# EAGLE design E4m (EAGLE 7.6.0)
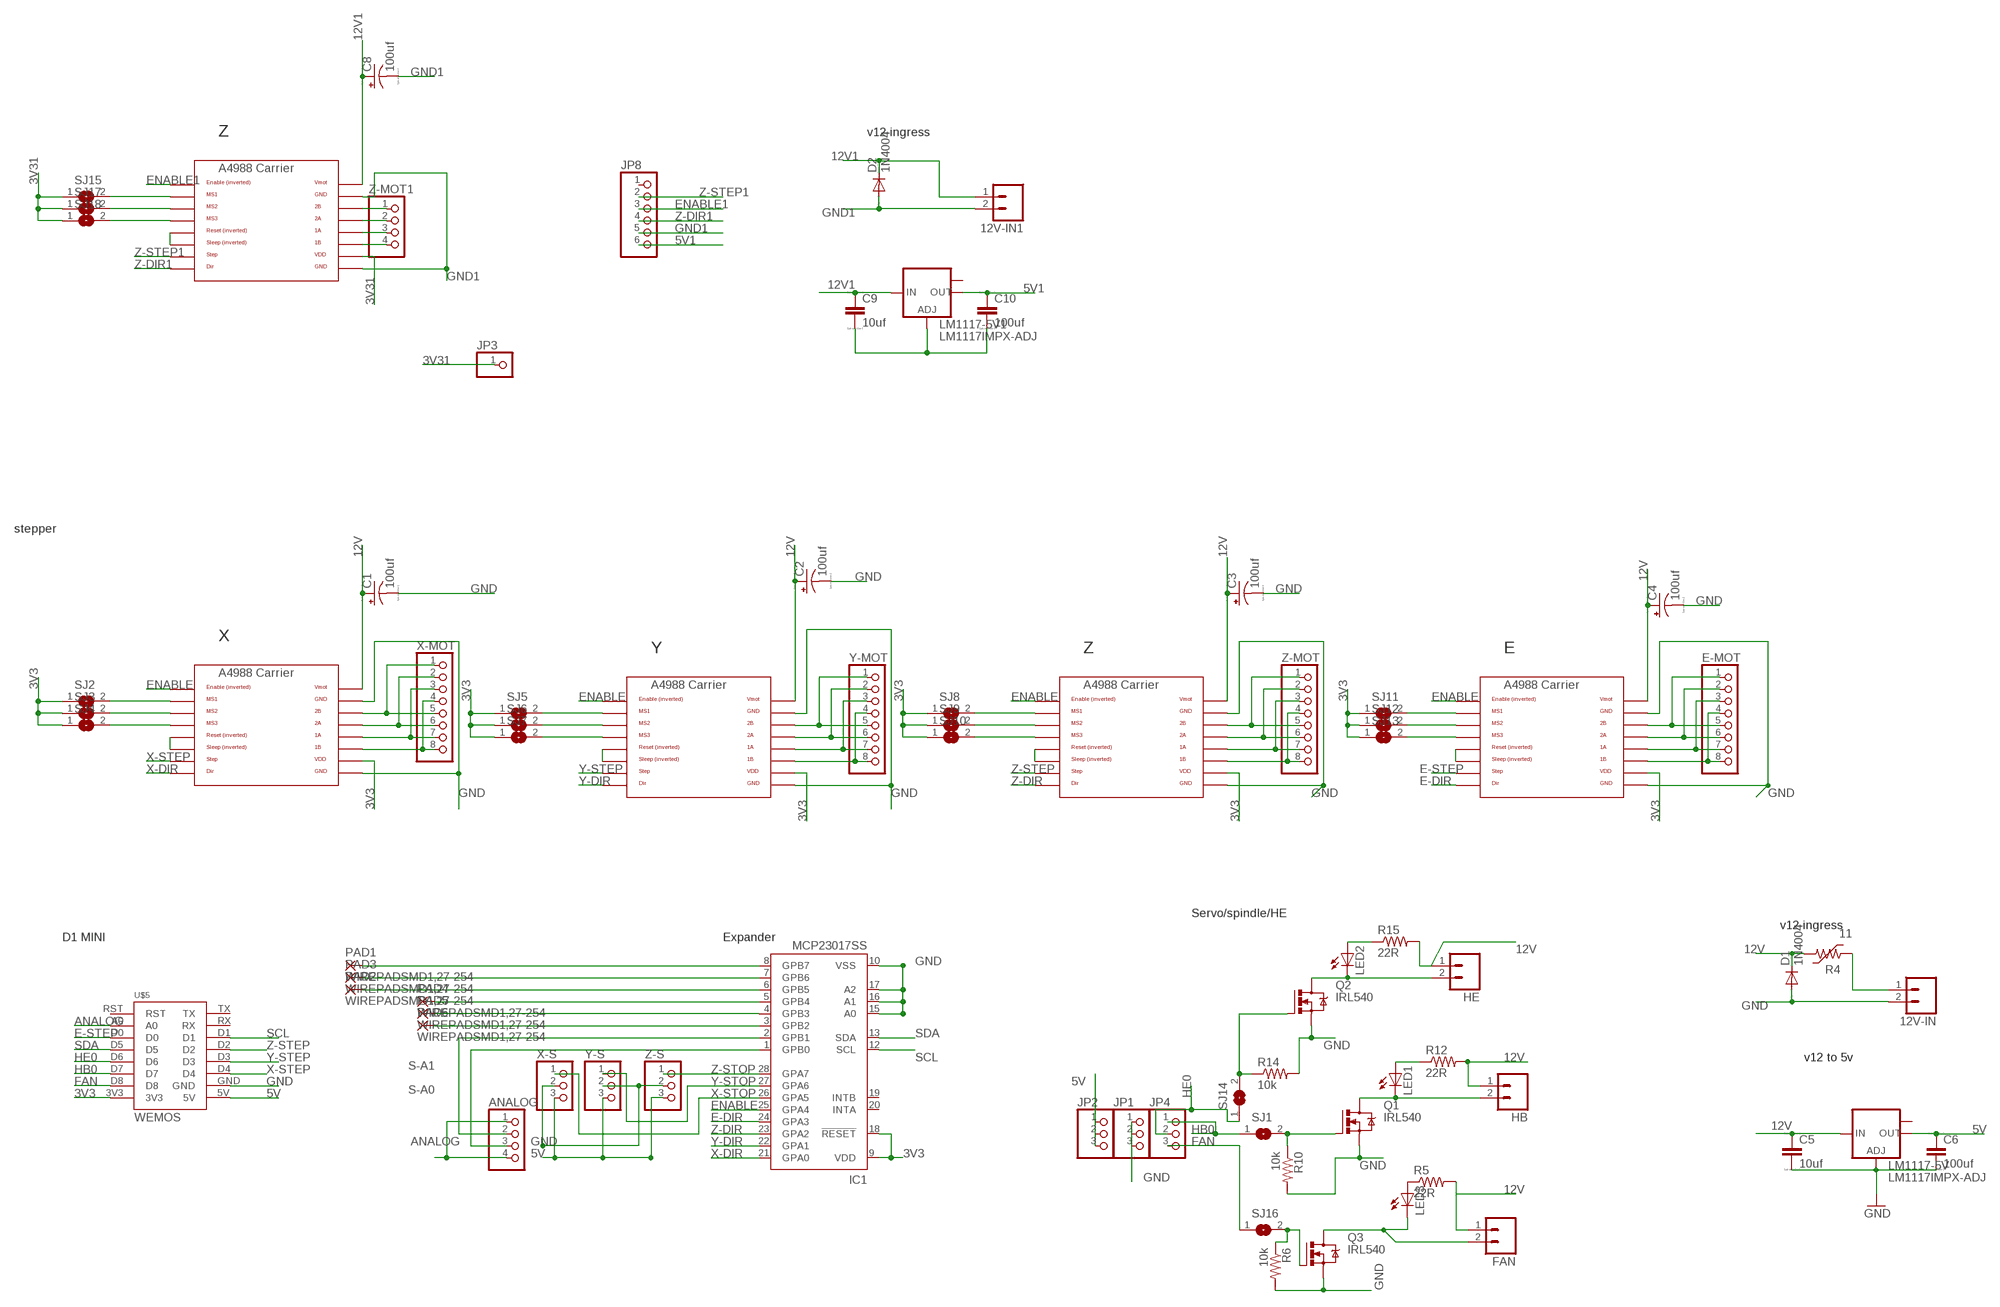
[diagram p0: schematic, sheet 1]

## Parts
12V-IN  M02PTH  [1X02]
12V-IN1  M02PTH  [1X02]
ANALOG  PINHD-1X4  [1X04]
C1  100uf  CPOL-US153CLV-0605  [153CLV-0605]
C2  100uf  CPOL-US153CLV-0605  [153CLV-0605]
C3  100uf  CPOL-US153CLV-0605  [153CLV-0605]
C4  100uf  CPOL-US153CLV-0605  [153CLV-0605]
C5  10uf  C  [C0805]
C6  100uf  C  [C0805]
C8  100uf  CPOL-US153CLV-0605  [153CLV-0605]
C9  10uf  CC0603  [C0603]
C10  100uf  CC0603  [C0603]
D1  1N4004  [DO41-10]
D2  1N4004  [DO41-10]
E-MOT  PINHD-1X8CLEANBIG  [1X08-CLEANBIG]
FAN  M02PTH  [1X02]
HB  M02PTH  [1X02]
HE  M02PTH  [1X02]
IC1  MCP23017SS  [SSOP28]
JP1  PINHD-1X3CB  [1X03-CLEANBIG]
JP2  PINHD-1X3CB  [1X03-CLEANBIG]
JP3  PINHD-1X1CB  [1X01-CLEANBIG]
JP4  PINHD-1X3CB  [1X03-CLEANBIG]
JP8  PINHD-1X6  [1X06]
LED1  LEDCHIP-LED0805  [CHIP-LED0805]
LED2  LEDCHIP-LED0805  [CHIP-LED0805]
LED3  LEDCHIP-LED0805  [CHIP-LED0805]
LM1117-5V  LM1117IMPX-ADJ  [SOT223]
LM1117-5V1  LM1117IMPX-ADJ  [SOT223]
PAD1  WIREPADSMD1,27-254  [SMD1,27-2,54]
PAD2  WIREPADSMD1,27-254  [SMD1,27-2,54]
PAD3  WIREPADSMD1,27-254  [SMD1,27-2,54]
PAD4  WIREPADSMD1,27-254  [SMD1,27-2,54]
PAD5  WIREPADSMD1,27-254  [SMD1,27-2,54]
PAD6  WIREPADSMD1,27-254  [SMD1,27-2,54]
Q1  IRL540  IRF540  [TO220BV]
Q2  IRL540  IRF540  [TO220BV]
Q3  IRL540  IRF540  [TO220BV]
R4  11  PTC-PF-8.0  [PF-8.0]
R5  22R  R-US_R0805  [R0805]
R6  10k  R-US_R0805  [R0805]
R10  10k  R-US_R0805  [R0805]
R12  22R  R-US_R0805  [R0805]
R14  10k  R-US_R0805  [R0805]
R15  22R  R-US_R0805  [R0805]
SJ1  SJ  [SJ]
SJ2  SJ  [SJ]
SJ3  SJ  [SJ]
SJ4  SJ  [SJ]
SJ5  SJ  [SJ]
SJ6  SJ  [SJ]
SJ7  SJ  [SJ]
SJ8  SJ  [SJ]
SJ9  SJ  [SJ]
SJ10  SJ  [SJ]
SJ11  SJ  [SJ]
SJ12  SJ  [SJ]
SJ13  SJ  [SJ]
SJ14  SJ  [SJ]
SJ15  SJ  [SJ]
SJ16  SJ  [SJ]
SJ17  SJ  [SJ]
SJ18  SJ  [SJ]
U$1  A4988BREAKOUT  [A4988BREAKOUT]
U$2  A4988BREAKOUT  [A4988BREAKOUT]
U$3  A4988BREAKOUT  [A4988BREAKOUT]
U$5  WEMOS  [WEMOS]
U$6  A4988BREAKOUT  [A4988BREAKOUT]
U$9  A4988BREAKOUT  [A4988BREAKOUT]
X-MOT  PINHD-1X8CLEANBIG  [1X08-CLEANBIG]
X-S  PINHD-1X3CB  [1X03-CLEANBIG]
Y-MOT  PINHD-1X8CLEANBIG  [1X08-CLEANBIG]
Y-S  PINHD-1X3CB  [1X03-CLEANBIG]
Z-MOT  PINHD-1X8CLEANBIG  [1X08-CLEANBIG]
Z-MOT1  PINHD-1X4  [1X04]
Z-S  PINHD-1X3CB  [1X03-CLEANBIG]

## Nets
3V3: IC1.9(VDD) IC1.18(!RESET) SJ2.1 SJ3.1 SJ4.1 SJ5.1 SJ6.1 SJ7.1 SJ8.1 SJ9.1 SJ10.1 SJ11.1 SJ12.1 SJ13.1 U$1.VDD U$2.VDD U$3.VDD U$5.3V3 U$9.VDD
3V31: JP3.1 SJ15.1 SJ17.1 SJ18.1 U$6.VDD
5V: C6.1 JP2.1 JP2.2 JP2.3 LM1117-5V.2(OUT) U$5.5V X-S.3 Y-S.3 Z-S.3
5V1: C10.1 JP8.6 LM1117-5V1.2(OUT)
12V [Power]: C1.+ C2.+ C3.+ C4.+ C5.1 D1.C FAN.1 HB.1 HE.1 LM1117-5V.3(IN) R4.2 R5.2 R12.2 R15.2 U$1.VMOT U$2.VMOT U$3.VMOT U$9.VMOT
12V1 [Power]: 12V-IN1.1 C8.+ C9.1 D2.C LM1117-5V1.3(IN) U$6.VMOT
ANALOG: ANALOG.1 ANALOG.4 U$5.A0
AUX2 [aux]: IC1.8(GPB7) PAD1.1(P)
E-DIR: IC1.24(GPA3) U$2.DIR
E-STEP: U$2.STEP U$5.D0
ENABLE: IC1.25(GPA4) U$1.EN U$2.EN U$3.EN U$9.EN
ENABLE1: JP8.3 U$6.EN
FAN: JP4.3 SJ16.1 U$5.D8
GND: 12V-IN.2 C1.- C2.- C3.- C4.- C5.2 C6.2 D1.A IC1.10(VSS) IC1.15(A0) IC1.16(A1) IC1.17(A2) JP1.1 JP1.2 JP1.3 LM1117-5V.1(ADJ) Q1.S Q2.S Q3.S R6.2 R10.2 R14.2 U$1.GND U$1.GND@0(GND) U$2.GND U$2.GND@0(GND) U$3.GND U$3.GND@0(GND) U$5.GND U$9.GND U$9.GND@0(GND) X-S.2 Y-S.2 Z-S.2
GND1: 12V-IN1.2 C8.- D2.A JP8.5 U$6.GND U$6.GND@0(GND)
HB0: JP4.1 SJ1.1 U$5.D7
HE0: JP4.2 SJ14.1 U$5.D6
N$1: LED3.A R5.1
N$3 [aux]: IC1.7(GPB6) PAD3.1(P)
N$4: SJ12.2 U$2.MS2
N$5: U$2.RST U$2.SLP(SLEEP)
N$6: SJ13.2 U$2.MS3
N$7: SJ11.2 U$2.MS1
N$8 [line]: U$3.1B Y-MOT.4 Y-MOT.8
N$9 [line]: U$3.1A Y-MOT.3 Y-MOT.7
N$10: U$3.2A Y-MOT.2 Y-MOT.6
N$11 [line]: U$3.2B Y-MOT.1 Y-MOT.5
N$12 [line]: U$1.1B X-MOT.4 X-MOT.8
N$13 [Power]: HB.2 LED1.C Q1.D
N$14 [line]: U$1.1A X-MOT.3 X-MOT.7
N$15: U$1.2A X-MOT.2 X-MOT.6
N$16 [line]: U$1.2B X-MOT.1 X-MOT.5
N$17 [line]: U$9.1B Z-MOT.4 Z-MOT.8
N$18: FAN.2 LED3.C Q3.D
N$19 [aux]: IC1.3(GPB2) PAD6.1(P)
N$20 [line]: U$9.1A Z-MOT.3 Z-MOT.7
N$21 [aux]: IC1.6(GPB5) PAD2.1(P)
N$22 [aux]: IC1.5(GPB4) PAD4.1(P)
N$23: Q2.G R14.1 SJ14.2
N$24: SJ3.2 U$1.MS2
N$25: U$9.RST U$9.SLP(SLEEP)
N$26 [aux]: IC1.4(GPB3) PAD5.1(P)
N$27: Q3.G R6.1 SJ16.2
N$28: U$3.RST U$3.SLP(SLEEP)
N$29: U$1.RST U$1.SLP(SLEEP)
N$30 [Power]: 12V-IN.1 R4.1
N$34: SJ4.2 U$1.MS3
N$35: SJ2.2 U$1.MS1
N$37: SJ17.2 U$6.MS2
N$39: SJ18.2 U$6.MS3
N$40: SJ15.2 U$6.MS1
N$41 [line]: U$6.2B Z-MOT1.1
N$42 [line]: U$6.2A Z-MOT1.2
N$43 [line]: U$6.1A Z-MOT1.3
N$44 [line]: U$6.1B Z-MOT1.4
N$45: U$6.RST U$6.SLP(SLEEP)
N$46: U$9.2A Z-MOT.2 Z-MOT.6
N$48 [line]: U$9.2B Z-MOT.1 Z-MOT.5
N$49: C9.2 C10.2 LM1117-5V1.1(ADJ)
N$50 [line]: E-MOT.4 E-MOT.8 U$2.1B
N$51 [line]: E-MOT.3 E-MOT.7 U$2.1A
N$54: LED1.A R12.1
N$55: E-MOT.2 E-MOT.6 U$2.2A
N$56: SJ6.2 U$3.MS2
N$57 [Power]: HE.2 LED2.C Q2.D
N$58: SJ7.2 U$3.MS3
N$59: SJ5.2 U$3.MS1
N$60 [line]: E-MOT.1 E-MOT.5 U$2.2B
N$64: SJ9.2 U$9.MS2
N$65: LED2.A R15.1
N$66: SJ10.2 U$9.MS3
N$67: SJ8.2 U$9.MS1
N$S4: Q1.G R10.1 SJ1.2
S-A0: ANALOG.3 IC1.1(GPB0)
S-A1: ANALOG.2 IC1.2(GPB1)
SCL: IC1.12(SCL) U$5.D1
SDA: IC1.13(SDA) U$5.D5
X-DIR: IC1.21(GPA0) U$1.DIR
X-STEP: U$1.STEP U$5.D4
X-STOP: IC1.26(GPA5) X-S.1
Y-DIR: IC1.22(GPA1) U$3.DIR
Y-STEP: U$3.STEP U$5.D3
Y-STOP: IC1.27(GPA6) Y-S.1
Z-DIR: IC1.23(GPA2) U$9.DIR
Z-DIR1: JP8.4 U$6.DIR
Z-STEP: U$5.D2 U$9.STEP
Z-STEP1: JP8.2 U$6.STEP
Z-STOP: IC1.28(GPA7) Z-S.1
Unconnected: IC1.19(INTB) IC1.20(INTA) JP8.1 LM1117-5V1.TAB(OUT1) LM1117-5V.TAB(OUT1) U$5.RST U$5.RX U$5.TX

## Notes on the sheet
- Z | v12 ingress
- stepper
- X
- Y | Z | E
- Servo/spindle/HE
- v12 ingress
- D1 MINI | Expander
- v12 to 5v

## Library data of the parts
12V-IN 12V-IN1 FAN HB HE = SparkFun:M02: Header 2 Standard 2-pin 0.1" header. Use with straight break away headers (SKU : PRT-00116), right angle break away headers (PRT-00553), swiss pins (PRT-00743), machine pins (PRT-00117), and female headers (PRT-00115). Molex polarized connector foot print use with SKU : PRT-08233 with associated crimp pins and housings.
ANALOG Z-MOT1 = RepRapjr:PINHD-1X4: PIN HEADER
C1-C4 C8 = resistor:CPOL-US: POLARIZED CAPACITOR, American symbol
C5 C6 C9 C10 = eagle-ltspice:C: CAPACITOR, European symbol; SPICEMODEL: NONE; SPICEPREFIX: C
D1 D2 = diode:1N4004: DIODE general purpose rectifier, 1 A
E-MOT X-MOT Y-MOT Z-MOT = adafruit:PINHD-1X8: PIN HEADER
IC1 = adafruit:MCP23017: http://ww1.microchip.com/downloads/en/DeviceDoc/21952a.pdf Source: http://ww1.microchip.com/downloads/en/DeviceDoc/21952a.pdf
JP1 JP2 JP4 X-S Y-S Z-S = adafruit:PINHD-1X3: PIN HEADER
JP3 = adafruit:PINHD-1X1: Pin header 1x1 for 0.1" spacing With round pins
JP8 = adafruit:PINHD-1X6: PIN HEADER
LED1-LED3 = RepRapjr:LED: LED OSRAM: - CHIPLED LG R971, LG N971, LY N971, LG Q971, LY Q971, LO R971, LY R971 LH N974, LH R974 LS Q976, LO Q976, LY Q976 LO Q996 - Hyper CHIPLED LW Q18S LB Q993, LB Q99A, LB R99A - SideLED LS A670, LO A670, LY A670, LG A670, LP A670 LB A673, LV A673, LT A673, LW A673 LH A674 LY A675 LS A676, LA A676, LO A676, LY A676, LW A676 LS A679, LY A679, LG A679 - Hyper Micro SIDELED® LS Y876, LA Y876, LO Y876, LY Y876 LT Y87S - SmartLED LW L88C, LW L88S LB L89C, LB L89S, LG L890 LS L89K, LO L89K, LY L89K LS L896, LA L896, LO L896, LY L896 - TOPLED LS T670, LO T670, LY T670, LG T670, LP T670 LSG T670, LSP T670, LSY T670, LOP T670, LYG T670 LG T671, LOG T671, LSG T671 LB T673, LV T673, LT T673, LW T673 LH T674 LS T676, LA T676, LO T676, LY T676, LB T676, LH T676, LSB T676, LW T676 LB T67C, LV T67C, LT T67C, LS T67K, LO T67K, LY T67K, LW E67C LS E67B, LA E67B, LO E67B, LY E67B, LB E67C, LV E67C, LT E67C LW T67C LS T679, LY T679, LG T679 LS T770, LO T770, LY T770, LG T770, LP T770 LB T773, LV T773, LT T773, LW T773 LH T774 LS E675, LA E675, LY E675, LS T675 LS T776, LA T776, LO T776, LY T776, LB T776 LHGB T686 LT T68C, LB T68C - Hyper Mini TOPLED® LB M676 - Mini TOPLED Santana® LG M470 LS M47K, LO M47K, LY M47K Source: http://www.osram.convergy.de LUXEON: - LUMILED® LXK2-PW12-R00, LXK2-PW12-S00, LXK2-PW14-U00, LXK2-PW14-V00 LXK2-PM12-R00, LXK2-PM12-S00, LXK2-PM14-U00 LXK2-PE12-Q00, LXK2-PE12-R00, LXK2-PE12-S00, LXK2-PE14-T00, LXK2-PE14-U00 LXK2-PB12-K00, LXK2-PB12-L00, LXK2-PB12-M00, LXK2-PB14-N00, LXK2-PB14-P00, LXK2-PB14-Q00 LXK2-PR12-L00, LXK2-PR12-M00, LXK2-PR14-Q00, LXK2-PR14-R00 LXK2-PD12-Q00, LXK2-PD12-R00, LXK2-PD12-S00 LXK2-PH12-R00, LXK2-PH12-S00 LXK2-PL12-P00, LXK2-PL12-Q00, LXK2-PL12-R00 Source: www.luxeon.com KINGBRIGHT: KA-3528ASYC Source: www.kingbright.com
LM1117-5V LM1117-5V1 = lm1117:LM1117IMPX-ADJ
PAD1-PAD6 = wirepad:WIREPAD: Wire PAD connect wire on PCB
Q1-Q3 = smootietransistor-power:IRF540: HEXFET Power MOSFET
R4 = polyswitch:PTC-: POLYSWITCH Polyswitch Resetable Fuses
R5 R6 R10 R12 R14 R15 = adafruit:R-US_: RESISTOR, American symbol
SJ1-SJ18 = jumper:SJ: SMD solder JUMPER
U$1-U$3 U$6 U$9 = RepRapjr:A4988BREAKOUT
U$5 = 1455413453956-wemos:WEMOS

## Net classes
1 Power: width 0.8 mm
2 line: width 0.4 mm
3 aux: width 0.2 mm

## Board
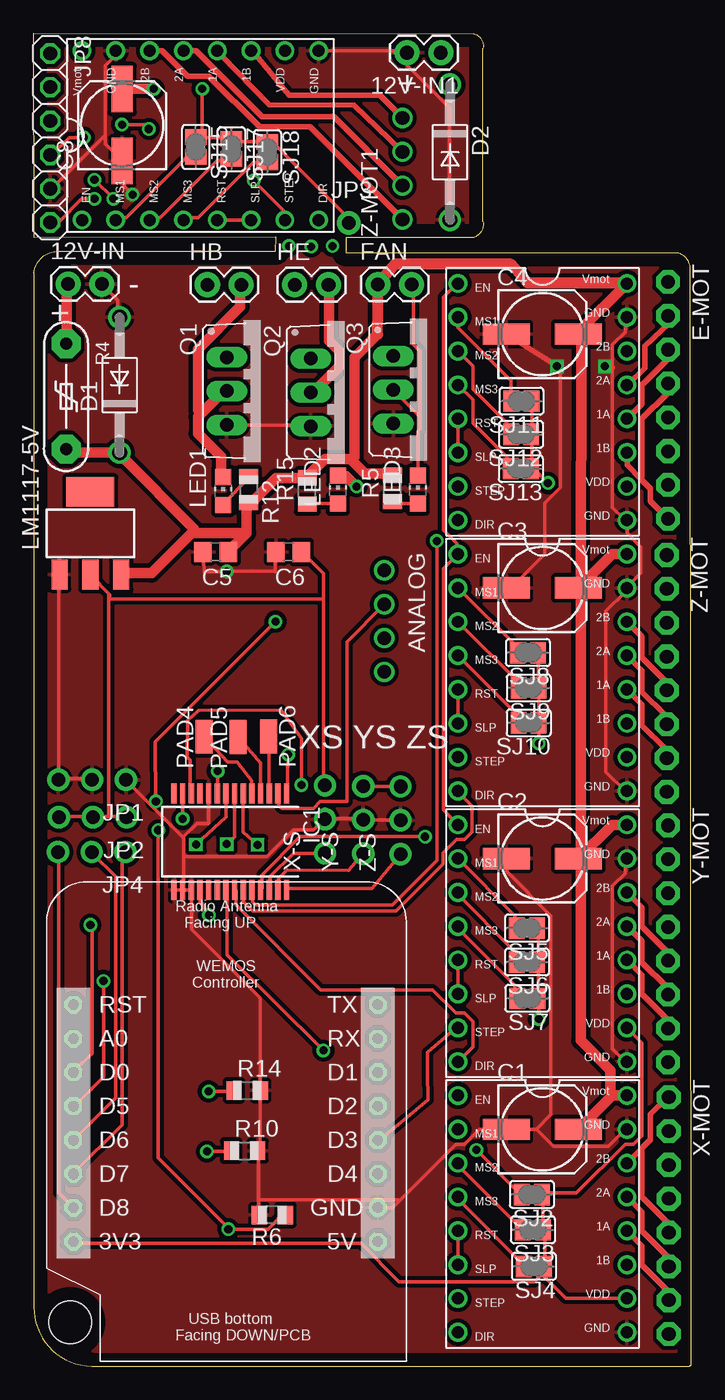
[diagram p1: board, top side]
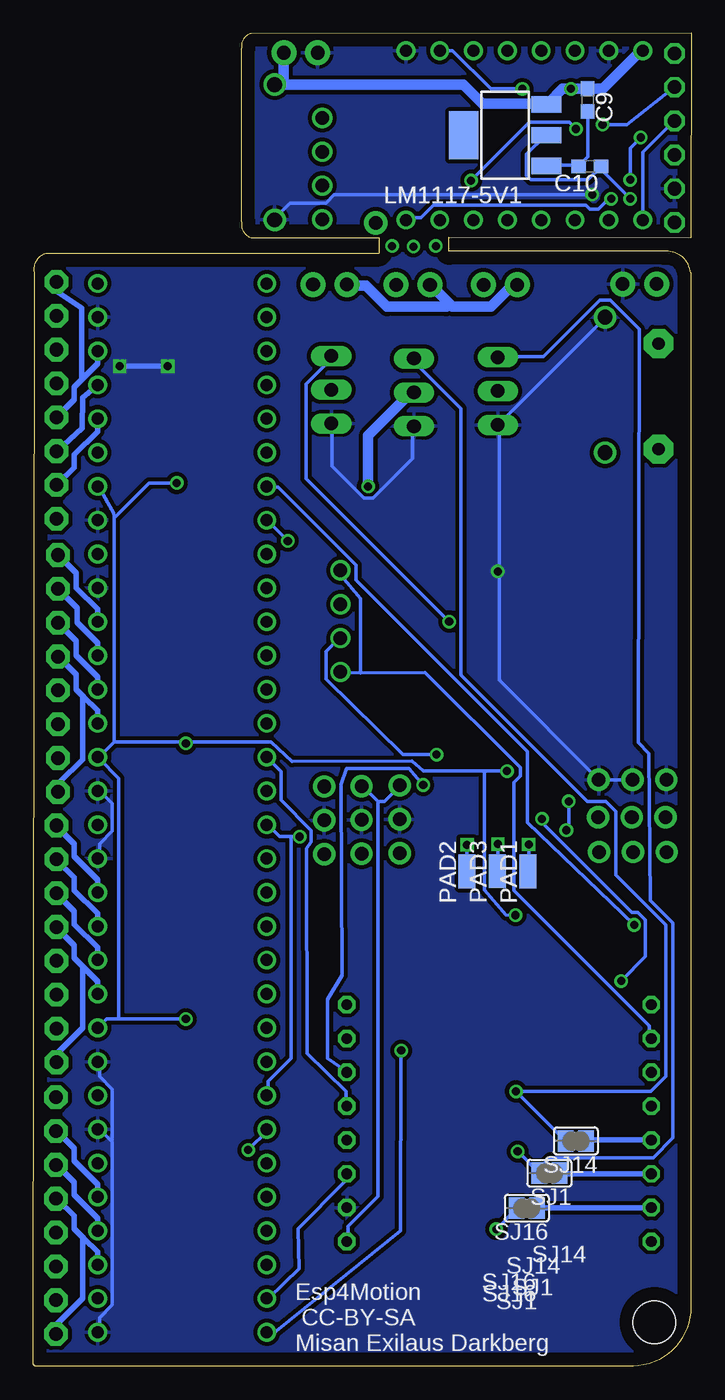
[diagram p2: board, bottom side, seen from below]

Size 49.41 x 100.05 mm. Coordinates in mm from the lower left corner, seen from the top.
Outline: 49.41,0.21 49.31,82.11 arc90 48.37,83.56 23.47,83.56 23.47,84.7 32.98,84.7 arc90 33.77,85.93 33.77,98.93 arc90 33.05,100.03 0.02,100.05
Outline: 0,100.05 0.03,84.73 18.22,84.75 18.19,83.69 2.07,83.69 arc90 0.05,82.07 0.05,4.47 arc90 4.37,0 49.2,0 arc90 49.41,0.21
Copper layers (1*16): Top 0.035mm / dielectric 1.5mm / Bottom 0.035mm
Design rules "default *": minimum track width 10mil, minimum drill 24mil, track to track 8mil, track to pad 8mil, pad to pad 8mil, via to via 8mil, smd to smd 8mil, copper to edge 40mil, drill to drill 8mil, minimum pad ring 10mil, minimum via ring 8mil, stop-mask expansion 4mil, vias tented up to drill 0mil, thermal gap 10mil
Holes 3.2 mm at 2.77,3.3

### Footprints (pad centres in the part's own frame; a part is rotated, then mirrored left to right if it is on the bottom)
1X02 = drill 1.016 pad 1.88: 1 0,0; 2 2.54,0
1X04 = drill 1.016: 1 -2.54,0; 2 0,0; 3 2.54,0; 4 5.08,0
153CLV-0605 = smd 3.5 x 1.6: + 2.7,0; - -2.7,0
C0805 = smd 1.3 x 1.5: 1 -0.95,0; 2 0.95,0
C0603 = smd 1.1 x 1: 1 -0.85,0; 2 0.85,0
DO41-10 = drill 1.118: A 5.08,0; C -5.08,0
1X08-CLEANBIG = drill 1.016 pad 1.778 octagon: 1 -8.89,0; 2 -6.35,0; 3 -3.81,0; 4 -1.27,0; 5 1.27,0; 6 3.81,0; 7 6.35,0; 8 8.89,0
SSOP28 = smd 0.4 x 1.5: 1 -4.225,-3.625; 2 -3.575,-3.625; 3 -2.925,-3.625; 4 -2.275,-3.625; 5 -1.625,-3.625; 6 -0.975,-3.625; 7 -0.325,-3.625; 8 0.325,-3.625; 9 0.975,-3.625; 10 1.625,-3.625; 11 2.275,-3.625; 12 2.925,-3.625; 13 3.575,-3.625; 14 4.225,-3.625; 15 4.225,3.625; 16 3.575,3.625; 17 2.925,3.625; 18 2.275,3.625; 19 1.625,3.625; 20 0.975,3.625; 21 0.325,3.625; 22 -0.325,3.625; 23 -0.975,3.625; 24 -1.625,3.625; 25 -2.275,3.625; 26 -2.925,3.625; 27 -3.575,3.625; 28 -4.225,3.625
1X03-CLEANBIG = drill 1.016 pad 1.676: 1 -2.54,0; 2 0,0; 3 2.54,0
1X01-CLEANBIG = drill 1.016 pad 1.778: 1 0,0
1X06 = drill 1.016 octagon: 1 -6.35,0; 2 -3.81,0; 3 -1.27,0; 4 1.27,0; 5 3.81,0; 6 6.35,0
CHIP-LED0805 = smd 1.2 x 1.2: A 0,-1.05; C 0,1.05
SOT223 = smd 1.219 x 2.235: 1 -2.311,-3.099; 2 0,-3.099; 3 2.311,-3.099 | smd 3.6 x 2.2: TAB 0,3.099
SMD1,27-2,54 = smd 1.27 x 2.54: 1 0,0
TO220BV = drill 1.016 long: D 0,-2.54; G -2.54,-2.54; S 2.54,-2.54
PF-8.0 = drill 0.914 pad 2.184 octagon: 1 -3.969,0; 2 3.969,0
R0805 = smd 1.1 x 1.4: 1 -1,0; 2 1,0
SJ = smd 1.168 x 1.6: 1 -0.762,0; 2 0.762,0
A4988BREAKOUT = drill 0.9: 1A 8.89,1.27; 1B 11.43,1.27; 2A 6.35,1.27; 2B 3.81,1.27; DIR 16.51,-11.43; EN -1.27,-11.43; GND 16.51,1.27; GND@0 1.27,1.27; MS1 1.27,-11.43; MS2 3.81,-11.43; MS3 6.35,-11.43; RST 8.89,-11.43; SLP 11.43,-11.43; STEP 13.97,-11.43; VDD 13.97,1.27; VMOT -1.27,1.27
WEMOS = drill 0.8 octagon: 3V3 0,0; 5V 22.86,0; A0 0,15.24; D0 0,12.7; D1 22.86,12.7; D2 22.86,10.16; D3 22.86,7.62; D4 22.86,5.08; D5 0,10.16; D6 0,7.62; D7 0,5.08; D8 0,2.54; GND 22.86,2.54; RST 0,17.78; RX 22.86,15.24; TX 22.86,17.78

### Placement (x,y rotation side)
12V-IN  2.61,81.24 0 top
12V-IN1  30.6,98.6 180 top
ANALOG  26.35,57.2 270 top
C1  38.23,17.78 0 top
C2  38.23,38.1 0 top
C3  38.23,58.42 0 top
C4  38.23,77.47 0 top
C5  13.69,61.13 180 top
C6  19.17,61.13 180 top
C8  6.67,93.16 90 top
C9  7.8,95.04 270 bottom
C10  7.62,90.06 180 bottom
D1  6.48,73.66 90 top
D2  31.29,91.13 270 top
E-MOT  47.67,72.5 270 top
FAN  25.87,81.2 0 top
HB  13.07,81.18 0 top
HE  19.63,81.18 0 top
IC1  14.79,39.38 180 top
JP1  4.42,44.02 180 top
JP2  4.47,41.2 180 top
JP3  23.7,85.83 0 top
JP4  4.39,38.6 180 top
JP8  1.27,92.2 270 top
LED1  14.27,65.7 0 top
LED2  22.87,65.8 0 top
LED3  28.87,65.8 0 top
LM1117-5V  4.29,62.53 0 top
LM1117-5V1  13.99,92.4 90 bottom
PAD1  12.27,37.13 0 bottom
PAD2  16.84,37.13 0 bottom
PAD3  14.55,37.16 0 bottom
PAD4  12.84,47.25 0 top
PAD5  15.39,47.22 0 top
PAD6  17.65,47.27 180 top
Q1  17.07,73.2 270 top
Q2  23.37,73.1 270 top
Q3  29.57,73.3 270 top
R4  2.46,72.8 270 top
R5  26.97,65.9 90 top
R6  17.94,11.36 180 top
R10  15.86,16.18 0 top
R12  16.17,65.8 270 top
R14  16.07,20.7 0 top
R15  20.57,65.7 90 top
SJ1  10.65,14.49 180 bottom
SJ2  37.44,12.88 180 top
SJ3  37.52,10.23 180 top
SJ4  37.6,7.49 180 top
SJ5  37.07,32.88 180 top
SJ6  37.07,30.33 180 top
SJ7  37.1,27.61 180 top
SJ8  37.15,53.56 180 top
SJ9  37.2,50.92 180 top
SJ10  37.2,48.3 180 top
SJ11  36.66,72.44 180 top
SJ12  36.63,69.95 180 top
SJ13  36.6,67.38 180 top
SJ14  8.67,16.9 180 bottom
SJ15  12.2,91.52 270 top
SJ16  12.36,11.86 180 bottom
SJ17  14.87,91.37 270 top
SJ18  17.58,91.14 270 top
U$1  43.31,19.05 270 top
U$2  43.31,80.01 270 top
U$3  43.31,39.37 270 top
U$5  3.01,9.36 0 top
U$6  4.92,97.47 0 top
U$9  43.31,59.69 270 top
X-MOT  47.72,11.3 270 top
X-S  21.9,41.05 90 top
Y-MOT  47.67,31.7 270 top
Y-S  24.77,41.01 90 top
Z-MOT  47.57,52 270 top
Z-MOT1  27.72,88.62 90 top
Z-S  27.58,40.98 90 top

### Tracks (layer width: path | path; a pad name or v marks a point on that pad's centre or on a via)
3V3  (via drill 0.61)
  Top 0.254: 44.42,5 U$1.VDD 39.99,5.08 38.25,6.83 SJ4.1 | SJ4.1 38.4,7.62 38.4,10.16 SJ3.1 38.25,10.32 38.25,12.86 SJ2.1 38.25,13.02 40.79,13.02 44.44,16.67 45.07,16.67 45.71,17.3 45.71,24.29 44.6,25.4 U$3.VDD | U$5.3V3 3.16,9.21 24.59,9.21 27.45,6.35 37.61,6.35 38.25,6.99 38.25,7.46 SJ4.1 | 37.93,48.42 SJ10.1 | 37.93,50.8 SJ9.1 | SJ8.1 37.93,53.5 37.93,50.96 SJ9.1 | SJ5.1 37.93,32.86 37.93,30.48 SJ6.1 37.93,30.32 37.93,27.62 SJ7.1 37.96,27.55 v37.96,26.06 | SJ11.1 37.45,72.39 37.45,70.01 SJ12.1 37.45,69.85 37.45,67.47 SJ13.1 37.5,67.44 v38.65,66.29 | SJ10.1 37.96,48.46 37.96,50.75 SJ9.1 | v13.84,44.68 13.84,43.09 IC1.9 | v37.96,46.75 37.96,48.23 SJ10.1 | v13.2,33.85 12.54,34.88 12.54,35.75 IC1.18
  Bottom 0.254: 42.99,26.06 43.9,26.06 44.48,25.49 U$3.VDD | 42.99,26.06 v37.96,26.06 | 15.54,44.68 20.12,44.7 20.97,45.43 29.98,45.4 31.56,46.86 37.96,46.86 | 15.54,44.68 v13.84,44.68 | 43.33,46.86 37.96,46.86 | 43.33,46.86 44.48,45.72 U$9.VDD 44.48,45.61 42.99,44.12 42.99,26.06 | v37.96,46.75 37.96,46.86 | 43.33,63.78 43.38,64.04 44.48,65.95 U$2.VDD | 43.33,46.86 43.33,63.78 | v38.65,66.29 40.7,66.29 43.22,63.78 43.33,63.78 | v13.2,33.85 13.92,33.87 15.54,35.75 15.54,44.5 15.54,44.68
3V31  (via drill 0.61)
  Top 0.254: 12.69,92.23 14.75,92.23 SJ17.1 14.91,92.08 15.07,91.92 17.45,91.92 SJ18.1 17.61,91.76 18.08,91.76 23.64,86.2 23.64,85.88 JP3.1 | 12.69,92.23 12.21,92.23 SJ15.1 12.69,92.23 | 12.69,92.23 v12.69,95.89
  Bottom 0.254: v12.69,95.89 15.07,95.89 17.93,98.74 18.88,98.74 U$6.VDD
5V
  Top 0.254: Z-S.3 27.54,43.5 24.79,43.5 Y-S.3 | JP2.3 2.04,41.25 4.42,41.25 JP2.2 4.54,41.25 5.67,41.25 | 5.67,41.25 6.92,41.25 JP2.1 | 21.79,57.57 21.79,43.62 X-S.3 | 21.79,57.57 21.79,59.5 20.17,61.12 C6.1 | 5.73,57.94 5.73,57.57 21.79,57.57 | 5.73,57.94 4.29,59.38 LM1117-5V.2 | 5.67,41.25 5.67,57.88 5.73,57.94
  Bottom 0.254: 23.54,42.38 23.54,12.75 25.79,10.5 25.79,9.38 U$5.5V | 23.54,42.38 24.67,43.5 Y-S.3 | 23.54,42.38 23.04,42.38 21.92,43.5 X-S.3
5V1  (via drill 0.61)
  Top 0.254: v4.59,87.63 3.64,87.63 1.89,85.88 1.42,85.88 JP8.6
  Bottom 0.254: LM1117-5V1.2 10.94,92.39 12.37,90.96 12.37,89.38 12.05,89.06 7.77,89.06 6.81,90.01 C10.1 6.81,89.85 v4.59,87.63
12V
  Top 0.8: R4.2 2.53,68.74 2.69,68.58 6.34,68.58 D1.C 6.65,68.26 12.05,62.87 11.89,62.55 | 15.78,62.31 14.75,61.28 C5.1 | 15.78,62.31 16.02,62.55 16.02,64.77 R12.2 16.5,64.93 18.24,66.67 20.47,66.67 R15.2 20.78,66.99 21.89,68.1 23.8,68.1 23.88,68.02 | 23.88,68.02 24.91,66.99 26.82,66.99 R5.2 | 11.89,62.55 8.88,59.53 6.65,59.53 LM1117-5V.3 | 11.89,62.55 15.54,62.55 15.78,62.31 | FAN.1 25.86,81.12 25.86,77.47 24.12,75.72 24.12,68.26 23.88,68.02 | U$2.VMOT 44.44,81.28 44.44,80.96 44.64,81.32 40.84,77.6 C4.+ 41.15,76.87 41.1,59.05 C3.+ | U$9.VMOT 43.48,60.96 40.94,58.42 C3.+ | 43.48,20.32 U$1.VMOT | 43.48,20.32 40.94,17.78 C1.+ | U$3.VMOT 43.48,40.64 40.94,38.1 C2.+ | 43.48,20.32 43.33,20.64 43.33,22.23 41.1,24.45 41.1,37.78 C2.+ | C3.+ 41.1,58.1 41.1,38.73 C2.+
  Top 0.813: 25.86,77.47 25.91,81.31 27.18,82.75 35.81,82.75 37.11,81.33 44.64,81.32
  Bottom 0.8: 18.16,79.77 19.51,81.12 HE.1 | 18.16,79.77 17.93,79.53 15.07,79.53 13.48,81.12 13.16,81.12 HB.1 | FAN.1 25.86,81.12 24.43,81.12 22.85,79.53 18.4,79.53 18.16,79.77
12V1  (via drill 0.61)
  Top 0.8: v9.04,95.89 6.81,95.89 C8.+
  Bottom 0.8: 7.92,95.89 v9.04,95.89 9.67,95.89 10.78,94.77 LM1117-5V1.3 11.26,94.77 15.7,94.77 17.13,96.2 31.26,96.2 D2.C 30.63,96.52 30.63,98.58 12V-IN1.1 | 7.92,95.89 6.65,95.89 4.11,98.42 U$6.VMOT | 7.92,95.89 C9.1
ANALOG
  Bottom 0.254: 24.83,52.02 26.34,52.07 ANALOG.4 | 24.83,52.02 19.99,52.07 12.85,44.93 12.85,44.29 13.32,43.81 13.32,35.72 3.16,25.56 3.16,24.61 U$5.A0 | 24.83,52.02 24.85,57.64 26.27,59.33 26.25,59.95 ANALOG.1
AUX2  (via drill 0.6)
  Top 0.254: IC1.8 14.47,41.24 v12.22,39.17
  Bottom 0.254: v12.22,39.17 12.24,37.16 PAD1.1
E-DIR  (via drill 0.61)
  Top 0.254: v30.3,61.95 30.3,37.95 26.99,34.63 16.7,34.63 16.47,34.86 16.47,35.66 IC1.24
  Bottom 0.254: v30.3,61.95 31.79,63.44 U$2.DIR
E-STEP  (via drill 0.61)
  Top 0.254: v4.29,33.12 4.42,33.12 4.42,23.5 3.04,22.12 U$5.D0
  Bottom 0.254: v4.29,33.12 12.29,40.8 12.29,46.12 25.17,59 25.17,60.12 31.04,66 31.79,66 U$2.STEP
ENABLE  (via drill 0.61)
  Top 0.254: v29.42,39.75 20.04,39.75 17.17,36.88 17.17,35.88 IC1.25 | U$3.EN 31.79,40.75 30.79,41.75 30.79,59.88 U$9.EN 31.79,61 31.79,61.75 30.79,62.75 30.79,80.25 31.79,81.25 U$2.EN
  Bottom 0.254: 30.07,39.75 30.92,39.75 31.79,40.62 U$3.EN | 30.07,39.75 v29.42,39.75 | U$1.EN 31.79,20.38 31.79,21.38 30.04,23.12 30.07,23.2 30.07,39.75
ENABLE1
  Bottom 0.254: U$6.EN 3.64,86.2 3.64,91.12 1.42,93.34 JP8.3
FAN
  Top 0.254: JP4.3 1.92,38.5 1.92,13 2.92,12 U$5.D8
  Bottom 0.406: U$5.D8 11.56,11.9 SJ16.1
GND  (via drill 0.6, 0.61)
  Top 0.254: 44.67,2.75 U$1.GND | D1.A 6.34,78.74 6.34,80.01 5.23,81.12 12V-IN.2 | Q1.S 14.59,70.64 20.78,70.64 Q2.S | U$2.GND@0 44.44,78.74 44.44,77.63 43.48,76.68 43.48,74.95 43.48,64.45 44.44,63.5 U$2.GND 44.59,63.44 44.59,62.52 45.62,61.49 45.62,59.55 44.59,58.52 U$9.GND@0 44.44,58.42 44.44,58.1 43.01,56.67 43.01,44.61 44.44,43.18 U$9.GND | 37.77,17.78 C1.- 33.48,17.78 32.37,16.67 31.74,16.67 27.49,12.43 | 37.77,17.78 39.04,16.51 43.17,16.51 44.44,17.78 U$1.GND@0 | U$3.GND@0 44.44,38.1 44.44,36.99 43.48,36.04 43.48,23.81 44.44,22.86 U$3.GND | 27.49,12.43 26.97,11.91 26.02,11.91 U$5.GND | 37.77,17.78 38.88,18.89 38.88,33.81 35.55,37.15 35.55,38.1 C2.- | C3.- 35.86,58.42 38.4,60.96 38.42,61.04 38.42,64.81 39.56,65.95 39.56,74.64 39.33,74.87 v39.32,75.06 | 38.4,75.56 38.44,75.62 | 16.48,59.7 18.14,59.67 18.17,61.12 C6.2 | 16.48,59.7 14.59,59.67 12.81,59.64 12.78,60.53 12.79,61.12 C5.2 | Z-S.2 27.54,41 24.79,41 Y-S.2 24.67,41.12 21.92,41.12 X-S.2 21.79,41 21.04,40.25 19.54,40.25 17.54,38.25 11.29,38.25 | LM1117-5V.1 1.92,59.38 1.92,44.12 JP1.3 2.04,44.12 4.29,44.12 JP1.2 | 16.92,12.5 16.92,11.38 R6.2 | 16.92,12.5 16.92,16.12 R10.2 17.04,16.12 17.04,20.62 R14.2 17.04,20.8 17.04,27.66 11.9,32.8 11.9,35.66 IC1.17 11.79,35.75 11.29,35.75 IC1.16 | 16.92,12.5 27.42,12.5 27.49,12.43 | IC1.15 10.67,35.75 11.17,35.75 IC1.16 | 11.29,39.75 12.29,40.75 13.17,40.75 IC1.10 | 11.29,38.25 11.29,35.88 IC1.16 | 11.29,38.25 11.29,39.75 | 11.29,39.75 11.17,39.75 6.92,44 JP1.1 | v14.53,59.66 16.48,59.7
  Top 0.406: C4.- 38.44,75.62 v39.32,75.06 | v42.93,75.06 43.48,74.95
  Bottom 0.254: U$3.GND@0 44.44,38.1 44.44,39.21 43.48,40.16 43.48,42.23 44.44,43.18 U$9.GND | 43.56,16.91 44.44,17.78 U$1.GND@0 | 43.56,16.91 43.48,16.83 43.48,4.6 44.44,3.65 44.44,2.54 U$1.GND | U$3.GND 44.44,22.86 44.44,21.75 43.48,20.8 43.48,16.99 43.56,16.91 | D1.A 6.54,78.62 14.42,70.75 Q1.S 14.42,70.62 14.42,59.66 | JP1.2 4.42,44 6.92,44 JP1.1 7.04,44.12 14.42,51.5 14.42,59.66 | Q3.S 26.99,70.75 26.99,67.55 24.59,65.15 23.9,65.15 20.93,68.12 20.93,70.52 Q2.S | v14.53,59.66 14.42,59.66
  Bottom 0.406: v39.32,75.06 v42.93,75.06
  pour Bottom (isolate 0.305): -1.69,-4.48 53.81,-4.48 53.81,84.02 -1.64,83.97
  pour Top (isolate 0.305): -0.95,-1.09 50.53,-1.09 50.53,83.78 -0.91,83.77 -0.94,83.74
GND1  (via drill 0.61)
  Top 0.254: 5.38,92.39 5.38,91.76 6.65,90.49 C8.- 6.81,90.33 6.81,88.58 v7.45,87.95 | 5.38,92.39 5.38,97.63 6.18,98.42 6.18,98.74 U$6.GND@0 | 5.38,92.39 1.42,88.42 JP8.5 | 26.97,98.74 27.93,98.74 12V-IN1.2 | 26.97,98.74 21.58,98.74 U$6.GND | 26.97,98.74 31.26,94.46 31.26,86.2 D2.A
  Bottom 0.254: v7.45,87.95 26.82,87.95 27.45,87.31 30.15,87.31 31.26,86.2 D2.A
  pour Top (isolate 0.305): -1.78,101.84 -1.78,84.14 35.24,84.14 35.24,101.95
  pour Bottom (isolate 0.305): -0.63,84.29 34.21,84.29 34.21,100.96 -0.54,100.7
HB0
  Top 0.254: JP4.1 6.92,38.5 6.67,38.25 6.67,18.12 3.04,14.5 U$5.D7
  Bottom 0.406: U$5.D7 9.84,14.44 SJ1.1
HE0
  Top 0.254: JP4.2 4.42,38.5 6.17,36.75 6.17,20.12 3.04,17 U$5.D6
  Bottom 0.406: U$5.D6 7.83,16.98 SJ14.1
N$1
  Top 0.254: LED3.A 28.72,64.77 26.97,64.77 R5.1
N$3  (via drill 0.6)
  Top 0.254: IC1.7 15.12,39.73 v14.53,39.19
  Bottom 0.254: v14.53,39.19 14.53,37.19 PAD3.1
N$4
  Top 0.254: SJ12.2 35.86,70.01 35.86,70.48 33.01,73.34 33.01,75.09 31.9,76.2 U$2.MS2
N$5
  Top 0.254: U$2.SLP 31.9,68.58 31.9,71.12 U$2.RST
N$6
  Top 0.254: SJ13.2 35.71,67.47 35.71,68.1 33.01,70.8 33.01,72.55 31.9,73.66 U$2.MS3
N$7
  Top 0.254: SJ11.2 35.86,72.55 35.86,73.98 31.9,77.95 31.9,78.74 U$2.MS1
N$8
  Bottom 0.4: 45.63,29.92 46.34,30.64 46.34,31.59 47.61,32.86 Y-MOT.4 | 45.63,29.92 44.6,28.89 44.6,27.94 U$3.1B | Y-MOT.8 47.61,22.86 47.61,23.5 45.71,25.4 45.71,29.84 45.63,29.92
N$9
  Top 0.4: Y-MOT.7 47.61,25.4 47.61,26.04 45.71,27.94 45.71,29.37 44.6,30.48 U$3.1A
  Bottom 0.4: U$3.1A 44.6,30.48 44.6,31.43 46.34,33.18 46.34,34.13 47.61,35.4 Y-MOT.3
N$10
  Top 0.254: 47.61,27.94 Y-MOT.6 | 44.6,33.02 U$3.2A
  Top 0.4: 47.61,27.94 47.61,28.42 45.71,30.32 45.71,31.91 44.6,33.02
  Bottom 0.254: 44.6,33.02 U$3.2A | 47.61,37.94 Y-MOT.2
  Bottom 0.4: 44.6,33.02 44.6,33.97 46.34,35.72 46.34,36.67 47.61,37.94
N$11
  Top 0.4: Y-MOT.5 47.61,30.48 47.61,31.11 45.71,33.02 45.71,34.45 44.6,35.56 U$3.2B
  Bottom 0.4: U$3.2B 44.6,35.56 44.6,36.51 46.34,38.26 46.34,39.21 47.61,40.48 Y-MOT.1
N$12
  Bottom 0.4: 45.63,9.6 46.34,10.32 46.34,11.27 47.61,12.54 X-MOT.4 | 45.63,9.6 44.6,8.57 44.6,7.62 U$1.1B | X-MOT.8 47.61,2.54 47.61,3.17 45.71,5.08 45.71,9.53 45.63,9.6
N$13
  Top 0.8: 12.61,71.52 14.43,73.34 Q1.D | 12.61,71.52 12.37,71.28 12.37,70.01 14.12,68.26 14.12,66.83 LED1.C | HB.2 15.54,81.12 15.54,79.53 12.37,76.36 12.37,71.75 12.61,71.52
N$14
  Top 0.4: X-MOT.7 47.61,5.08 47.61,5.71 45.71,7.62 45.71,9.05 44.6,10.16 U$1.1A
  Bottom 0.4: U$1.1A 44.6,10.16 44.6,11.11 46.34,12.86 46.34,13.81 47.61,15.08 X-MOT.3
N$15
  Top 0.254: 44.6,12.7 U$1.2A
  Top 0.4: 44.6,12.7 45.71,11.59 45.71,10.16 47.61,8.26 47.61,7.62 X-MOT.6
  Bottom 0.254: 44.6,12.7 U$1.2A | 47.61,17.62 X-MOT.2
  Bottom 0.4: 44.6,12.7 44.6,13.65 46.34,15.4 46.34,16.35 47.61,17.62
N$16
  Top 0.4: 45.63,16.27 46.34,16.99 46.34,18.89 47.61,20.16 X-MOT.1 | 45.63,16.27 44.6,15.24 U$1.2B | X-MOT.5 47.61,10.16 47.61,10.79 45.71,12.7 45.71,16.19 45.63,16.27
N$17
  Bottom 0.4: 45.63,50.24 46.18,50.8 46.18,51.91 47.45,53.18 Z-MOT.4 | 45.63,50.24 44.6,49.21 44.6,48.26 U$9.1B | Z-MOT.8 47.45,43.18 47.45,43.81 45.71,45.56 45.71,50.16 45.63,50.24
N$18
  Top 0.254: 28.96,71.36 27.13,73.18 Q3.D | 28.96,71.36 29.04,71.28 29.04,70.33 28.88,70.17 28.88,66.99 LED3.C | FAN.2 28.56,81.12 28.56,76.68 29.04,76.2 29.04,71.44 28.96,71.36
  Bottom 0.254: 28.47,81.15 FAN.2
N$19
  Top 0.254: PAD6.1 17.72,47.21 IC1.3
N$20
  Top 0.4: Z-MOT.7 47.45,45.72 47.45,46.35 45.71,48.1 45.71,49.69 44.6,50.8 U$9.1A
  Bottom 0.4: U$9.1A 44.6,50.8 44.6,51.75 46.18,53.34 46.18,54.45 47.45,55.72 Z-MOT.3
N$21  (via drill 0.6)
  Top 0.254: IC1.6 15.77,40.11 v16.84,39.14
  Bottom 0.254: v16.84,39.14 16.81,37.16 PAD2.1
N$22
  Top 0.254: IC1.5 16.41,43.97 15.29,45.35 14.6,45.35 PAD4.1
N$23  (via drill 0.61)
  Top 0.254: v13.17,20.62 15.04,20.62 R14.1
  Bottom 0.254: SJ14.2 9.54,17 v13.17,20.62 3.04,20.62 1.92,21.75 1.92,33.12 5.67,36.88 5.67,41.62 6.42,42.38 7.79,42.38 17.29,51.88 17.29,71.88 20.79,75.38 20.79,75.62 Q2.G
N$24
  Top 0.254: SJ3.2 36.66,10.32 31.74,15.24 U$1.MS2
N$25
  Top 0.254: U$9.SLP 31.9,48.26 31.9,50.8 U$9.RST
N$26
  Top 0.254: PAD5.1 17.07,45.29 IC1.4
N$27  (via drill 0.61)
  Top 0.254: R6.1 18.87,11.32 18.64,11.32 17.61,10.29 v14.64,10.29 14.64,10.4 9.39,15.66 v9.39,40.23 | v18.19,55.89 9.16,46.87 v9.2,42.4
  Bottom 0.254: v14.64,10.29 13.16,11.77 SJ16.2 | v18.19,55.89 28.93,66.64 28.93,73.72 27.1,75.55 27.1,75.78 Q3.G | v9.2,42.4 9.21,40.24 v9.39,40.23
N$28
  Top 0.254: U$3.SLP 31.9,27.94 31.9,30.48 U$3.RST
N$29
  Top 0.254: U$1.SLP 31.9,7.62 31.9,10.16 U$1.RST
N$30
  Top 0.8: 12V-IN.1 2.53,81.12 2.53,76.83 R4.1
N$31  (via drill 0.6)
  other vias: 19.2,84.09
N$32  (via drill 0.6)
  other vias: 20.87,84.04
N$33  (via drill 0.6)
  other vias: 22.47,84.09
N$34
  Top 0.254: SJ4.2 36.82,7.62 31.74,12.7 U$1.MS3
N$35  (via drill 0.61)
  Top 0.254: v33.27,16.23 36.59,12.92 SJ2.2
  Bottom 0.254: v33.27,16.23 31.79,17.72 U$1.MS1
N$37
  Top 0.254: SJ17.2 14.75,90.49 13.8,90.49 9.51,86.2 8.88,86.2 U$6.MS2
N$39
  Top 0.254: SJ18.2 17.45,90.33 16.5,90.33 12.37,86.2 11.42,86.2 U$6.MS3
N$40
  Top 0.254: SJ15.2 12.05,90.65 11.42,90.65 6.97,86.2 6.34,86.2 U$6.MS1
N$41
  Top 0.4: U$6.2B 8.88,98.74 9.67,98.74 11.58,96.84 13.16,96.84 16.97,93.03 20.78,93.03 27.61,86.2 Z-MOT1.1
N$42
  Top 0.4: U$6.2A 11.42,98.74 12.21,98.74 17.18,93.81 22.58,93.81 27.61,88.74 Z-MOT1.2
N$43
  Top 0.4: U$6.1A 13.96,98.74 14.13,98.38 17.69,94.7 24.08,94.67 27.61,91.28 Z-MOT1.3
N$44
  Top 0.4: U$6.1B 16.5,98.74 16.56,98.63 19.2,95.41 26.02,95.41 27.61,93.82 Z-MOT1.4
N$45
  Top 0.254: U$6.RST 13.96,86.04 U$6.SLP
N$46
  Top 0.254: 47.45,48.26 Z-MOT.6 | 44.6,53.34 U$9.2A
  Top 0.4: 47.45,48.26 47.45,48.87 45.71,50.62 45.71,52.23 44.6,53.34
  Bottom 0.254: 44.6,53.34 U$9.2A | 47.45,58.26 Z-MOT.2
  Bottom 0.4: 44.6,53.34 44.6,54.29 46.11,55.81 46.11,56.92 47.45,58.26
N$48
  Top 0.4: Z-MOT.5 47.45,50.8 47.45,51.44 45.71,53.18 45.71,54.77 44.6,55.88 U$9.2B
  Bottom 0.4: U$9.2B 44.6,55.88 44.6,56.83 46.18,58.42 46.18,59.53 47.45,60.8 Z-MOT.1
N$49
  Bottom 0.254: C9.2 7.77,94.14 7.77,90.81 8.4,90.17 C10.2 8.56,90.17 10.78,90.17 LM1117-5V1.1
N$50
  Top 0.4: 45.63,66.6 46.34,65.88 46.34,64.93 47.61,63.66 E-MOT.8 | 45.63,66.6 44.6,67.63 44.6,68.58 U$2.1B | E-MOT.4 47.61,73.66 47.61,73.03 45.71,71.12 45.71,66.67 45.63,66.6
N$51
  Top 0.4: E-MOT.3 47.61,76.2 47.61,75.56 45.71,73.66 45.71,72.23 44.6,71.12 U$2.1A
  Bottom 0.4: U$2.1A 44.6,71.12 44.6,70.17 46.34,68.42 46.34,67.47 47.61,66.2 E-MOT.7
N$54
  Top 0.254: LED1.A 14.27,64.77 16.18,66.67 R12.1
N$55  (via drill 0.6)
  Top 0.254: v44.6,73.66 U$2.2A
  Top 0.406: v44.6,73.66 45.92,74.93 45.92,76.56 47.75,78.28 E-MOT.2
  Bottom 0.406: v44.6,73.66 45.7,72.71 45.75,70.42 47.64,68.69 E-MOT.6
N$56
  Top 0.254: SJ6.2 36.18,30.48 36.18,31.11 31.74,35.56 U$3.MS2
N$57  (via drill 0.61)
  Top 0.8: v24.28,66.04 23.48,66.83 23.01,66.83 LED2.C | HE.2 22.21,81.12 22.21,76.99 23.01,76.2 23.01,75.09 20.94,73.03 Q2.D
  Bottom 0.8: v24.28,66.04 24.28,69.85 20.94,73.18 Q2.D
N$58
  Top 0.254: SJ7.2 36.18,27.62 36.18,28.57 31.74,33.02 U$3.MS3
N$59
  Top 0.254: SJ5.2 36.18,33.02 36.18,33.81 31.9,38.1 U$3.MS1
N$60
  Bottom 0.4: 45.63,74.22 46.34,73.5 46.34,72.55 47.61,71.28 E-MOT.5 | 45.63,74.22 44.6,75.25 44.6,76.2 U$2.2B | E-MOT.1 47.61,81.28 47.61,80.64 45.77,79.42 45.77,74.11 45.63,74.22
N$64
  Top 0.254: SJ9.2 36.34,50.96 36.34,51.44 31.9,55.88 U$9.MS2
N$65
  Top 0.254: LED2.A 22.85,64.77 20.62,64.77 R15.1
N$66
  Top 0.254: SJ10.2 36.34,48.42 36.34,48.9 31.9,53.34 U$9.MS3
N$67
  Top 0.254: SJ8.2 36.34,53.66 36.34,53.98 31.9,58.42 U$9.MS1
N$S4  (via drill 0.61)
  Top 0.254: v13.04,16.12 14.76,16.12 R10.1
  Bottom 0.254: v13.04,16.12 11.44,14.52 SJ1.2 11.56,14.74 10.64,15.66 2.87,15.66 1.38,17.14 1.38,33.26 3.1,34.98 3.18,46 3.98,46.8 3.9,77.84 6.07,80.01 6.87,80.01 11.1,75.78 14.53,75.78 Q1.G
S-A0  (via drill 0.61)
  Top 0.254: v19.13,45.91 19.04,43.02 IC1.1
  Bottom 0.254: v19.13,45.91 21.65,45.92 27.45,51.59 27.45,53.66 26.5,54.61 ANALOG.3
S-A1
  Top 0.254: IC1.2 18.42,43 18.42,42.12 18.67,41.88 21.04,41.88 21.54,42.38 23.54,42.38 23.54,54.38 26.29,57.12 ANALOG.2
SCL  (via drill 0.61)
  Top 0.254: v20.14,43.63 20.14,47.12 18.61,49.26 12.41,49.24 11.6,48.47 11.56,45.72 11.79,45.49 11.79,43.09 IC1.12
  Bottom 0.254: v20.14,43.63 21.21,44.88 25.9,44.88 26.3,43.66 26.24,29.32 27.3,27.55 27.3,23.09 25.96,22.17 U$5.D1
SDA  (via drill 0.61)
  Top 0.254: v11.21,41.08 11.21,42.98 IC1.13 | v5.27,28.92 5.27,21.72 3.1,19.55 U$5.D5
  Bottom 0.254: v11.21,41.08 11.21,40.8 4.47,34.06 4.01,34.06 3.44,33.49 3.44,30.75 v5.27,28.92
X-DIR  (via drill 0.61)
  Top 0.254: v21.79,23.7 14.54,30.88 14.54,35.75 IC1.21
  Bottom 0.254: v21.79,23.7 21.85,10.18 31.17,2.62 31.79,2.62 U$1.DIR
X-STEP
  Bottom 0.254: U$5.D4 26.02,14.29 26.09,13.81 29.52,10.31 29.46,7.29 31.74,5.08 U$1.STEP
X-STOP
  Top 0.254: IC1.26 17.79,35.88 17.79,36.75 19.54,38.5 21.79,38.5 X-S.1
Y-DIR
  Top 0.254: IC1.22 15.23,35.72 15.23,34.61 21.58,28.26 29.99,28.26 31.74,26.51 32.37,26.51 33.01,25.88 33.01,23.97 31.9,22.86 U$3.DIR
Y-STEP
  Top 0.254: U$5.D3 26.02,16.99 29.63,20 29.59,22.07 29.61,23.55 31.74,25.4 U$3.STEP
Y-STOP
  Top 0.254: IC1.27 18.42,35.88 18.42,36.62 19.04,37.25 23.68,37.21 24.67,38.38 Y-S.1
Z-DIR
  Top 0.254: IC1.23 15.79,35.66 15.79,34.86 16.47,34.18 27.22,34.18 30.76,37.72 30.76,38.52 31.79,39.55 32.36,39.55 32.93,40.12 32.93,42.06 31.9,43.09 U$9.DIR
Z-DIR1  (via drill 0.61)
  Top 0.254: v4.59,89.06 v6.02,87.63 | v3.8,92.23 2.69,92.23 1.42,90.96 JP8.4
  Bottom 0.254: v6.02,87.63 6.18,87.63 6.97,86.84 7.61,86.84 7.92,87.15 19.35,87.15 20.31,86.2 21.42,86.2 U$6.DIR | v4.59,89.06 4.59,91.44 v3.8,92.23
Z-STEP
  Bottom 0.254: U$5.D2 25.92,19.62 25.92,20.62 28.87,23.5 28.88,38.85 28.54,39.36 28.54,40.23 30.79,42.5 30.79,44.62 31.79,45.62 U$9.STEP
Z-STEP1  (via drill 0.61)
  Top 0.254: v16.54,89 18.79,86.75 18.79,86.12 U$6.STEP | v8.67,92.88 8.28,93.18 v6.67,93.2
  Bottom 0.254: v16.54,89 12.17,93.38 9.17,93.38 v8.67,92.88 | v6.67,93.2 4.84,93.2 1.29,96 JP8.2
Z-STOP
  Top 0.254: IC1.28 19.04,35.88 25.42,35.88 27.54,38.38 Z-S.1

### Text on the board
tPlace: + | - | + | XS YS ZS
bPlace: Esp4Motion / CC-BY-SA / Misan Exilaus Darkberg
_bNames: C9 | C10 | LM1117-5V1 | PAD1 | PAD3 | PAD2 | SJ14 | SJ14 | SJ1 | SJ16 | SJ1 | SJ16